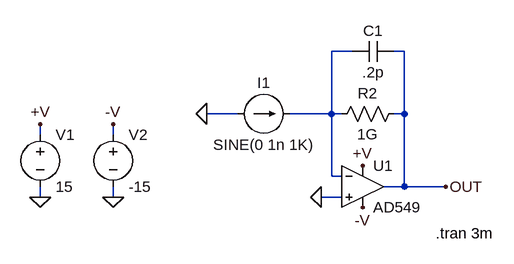
[diagram p0: schematic AD549.asc]
AD549.asc, the LTspice schematic file:
Version 4
SHEET 1 1240 700
WIRE 560 -1312 528 -1312
WIRE 640 -1312 624 -1312
WIRE 384 -1216 336 -1216
WIRE 528 -1216 528 -1312
WIRE 528 -1216 464 -1216
WIRE 544 -1216 528 -1216
WIRE 640 -1216 640 -1312
WIRE 640 -1216 624 -1216
WIRE 80 -1184 80 -1200
WIRE 192 -1184 192 -1200
WIRE 528 -1120 528 -1216
WIRE 544 -1120 528 -1120
WIRE 640 -1104 640 -1216
WIRE 640 -1104 608 -1104
WIRE 704 -1104 640 -1104
WIRE 80 -1088 80 -1104
WIRE 192 -1088 192 -1104
WIRE 544 -1088 512 -1088
FLAG 80 -1200 +V
FLAG 80 -1088 0
FLAG 704 -1104 OUT
FLAG 576 -1136 +V
FLAG 192 -1200 -V
FLAG 576 -1072 -V
FLAG 336 -1216 0
FLAG 192 -1088 0
FLAG 512 -1088 0
SYMBOL voltage 80 -1200 R0
WINDOW 123 0 0 Left 2
WINDOW 39 0 0 Left 2
SYMATTR InstName V1
SYMATTR Value 15
SYMBOL res 640 -1232 R90
WINDOW 0 0 56 VBottom 2
WINDOW 3 32 56 VTop 2
SYMATTR InstName R2
SYMATTR Value 1G
SYMBOL voltage 192 -1200 R0
WINDOW 123 24 146 Left 2
WINDOW 39 24 125 Left 2
SYMATTR InstName V2
SYMATTR Value -15
SYMBOL AD549 576 -1168 R0
SYMATTR InstName U1
SYMBOL current 384 -1216 R270
WINDOW 0 32 40 VTop 2
WINDOW 3 -32 40 VBottom 2
SYMATTR InstName I1
SYMATTR Value SINE(0 1n 1K)
SYMBOL cap 624 -1328 R90
WINDOW 0 0 32 VBottom 2
WINDOW 3 32 32 VTop 2
SYMATTR InstName C1
SYMATTR Value .2p
TEXT 688 -1032 Left 2 !.tran 3m

The netlist it stands for:
* AD549.asc
V1 +V 0 15
R2 OUT N001 1G
V2 -V 0 -15
XU1 0 N001 +V -V OUT AD549  ; pins In+ In- V+ V- OUT
I1 0 N001 SINE(0 1n 1K)
C1 OUT N001 .2p
.tran 3m
.backanno
.end